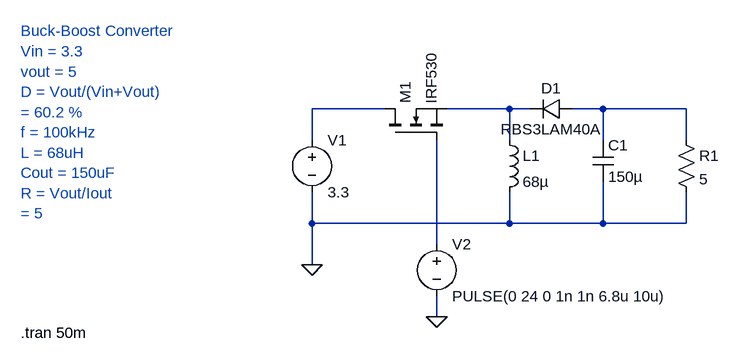
[diagram p0: schematic BuckBoost.asc]
BuckBoost.asc, the LTspice schematic file:
Version 4.1
SHEET 1 1160 680
WIRE 448 128 336 128
WIRE 640 128 544 128
WIRE 672 128 640 128
WIRE 784 128 736 128
WIRE 912 128 784 128
WIRE 336 176 336 128
WIRE 640 176 640 128
WIRE 784 176 784 128
WIRE 912 176 912 128
WIRE 336 304 336 256
WIRE 640 304 640 256
WIRE 640 304 336 304
WIRE 784 304 784 240
WIRE 784 304 640 304
WIRE 912 304 912 256
WIRE 912 304 784 304
WIRE 528 336 528 176
WIRE 336 368 336 304
WIRE 528 448 528 416
FLAG 336 368 0
FLAG 528 448 0
SYMBOL voltage 336 160 R0
WINDOW 123 0 0 Left 0
WINDOW 39 0 0 Left 0
SYMATTR InstName V1
SYMATTR Value 3.3
SYMBOL ind 624 160 R0
SYMATTR InstName L1
SYMATTR Value 68µ
SYMBOL res 896 160 R0
SYMATTR InstName R1
SYMATTR Value 5
SYMBOL cap 768 176 R0
SYMATTR InstName C1
SYMATTR Value 150µ
SYMBOL diode 736 112 R90
WINDOW 0 0 32 VBottom 2
WINDOW 3 32 32 VTop 2
SYMATTR InstName D1
SYMATTR Value RBS3LAM40A
SYMATTR Description Diode
SYMATTR Type diode
SYMBOL nmos 448 176 R270
SYMATTR InstName M1
SYMATTR Value IRF530
SYMBOL voltage 528 320 R0
WINDOW 123 0 0 Left 0
WINDOW 39 0 0 Left 0
SYMATTR InstName V2
SYMATTR Value PULSE(0 24 0 1n 1n 6.8u 10u)
TEXT -112 8 Left 2 ;Buck-Boost Converter\nVin = 3.3\nvout = 5\nD = Vout/(Vin+Vout)\n= 60.2 %\nf = 100kHz\nL = 68uH\nCout = 150uF\nR = Vout/Iout\n= 5
TEXT -112 472 Left 2 !.tran 50m

The netlist it stands for:
* BuckBoost.asc
V1 N001 0 3.3
L1 N002 0 68µ
R1 N003 0 5
C1 N003 0 150µ
D1 N003 N002 RBS3LAM40A
M1 N001 N004 N002 N002 IRF530
V2 N004 0 PULSE(0 24 0 1n 1n 6.8u 10u)
.model D D
.lib standard.dio
.model NMOS NMOS
.model PMOS PMOS
.lib standard.mos
* Buck-Boost Converter
* Vin = 3.3
* vout = 5
* D = Vout/(Vin+Vout)
* = 60.2 %
* f = 100kHz
* L = 68uH
* Cout = 150uF
* R = Vout/Iout
* = 5
.tran 50m
.backanno
.end